# Altium schematic sheet 遥控器.SchDoc
size A4
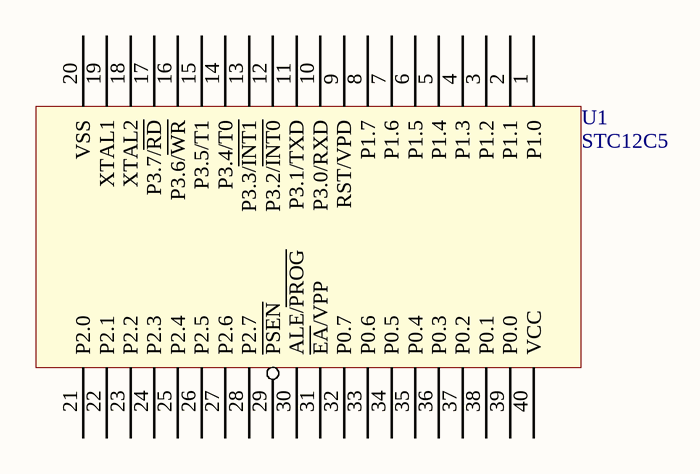
[diagram p0: 遥控器.SchDoc]

## Parts
U1  STC12C5  [STC89C52RC]

## Nets

Not connected (* = marked no-connect by the designer): U1 1(P1.0) 2(P1.1) 3(P1.2) 4(P1.3) 5(P1.4) 6(P1.5) 7(P1.6) 8(P1.7) 9(RST/VPD) 10(P3.0/RXD) 11(P3.1/TXD) 12(P3.2/~{INT0}) 13(P3.3/~{INT1}) 14(P3.4/T0) 15(P3.5/T1) 16(P3.6/~{WR}) 17(P3.7/~{RD}) 18(XTAL2) 19(XTAL1) 20(VSS) 21(P2.0) 22(P2.1) 23(P2.2) 24(P2.3) 25(P2.4) 26(P2.5) 27(P2.6) 28(P2.7) 29(~{PSEN}) 30(ALE/~{PROG}) 31(~{EA}/VPP) 32(P0.7) 33(P0.6) 34(P0.5) 35(P0.4) 36(P0.3) 37(P0.2) 38(P0.1) 39(P0.0) 40(VCC)

## Library data of the parts
U1 = STC89C52RC